# Altium schematic sheet 20_Power_Supply.SchDoc
size A4
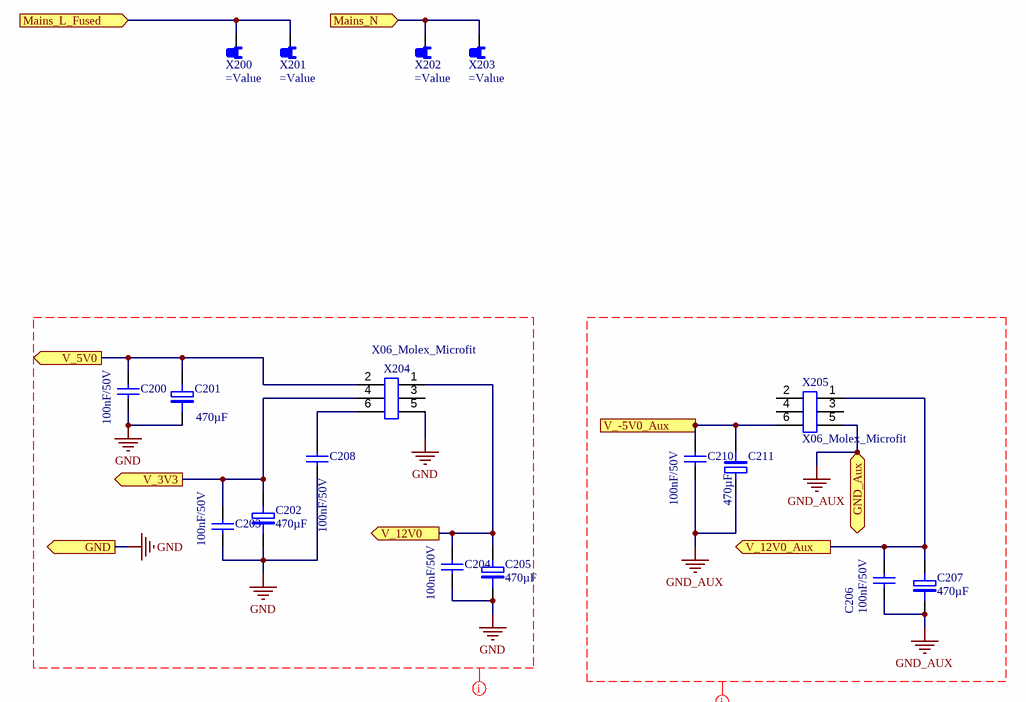
[diagram p0: 20_Power_Supply.SchDoc]

## Parts
C200  100nF/50V  [EIA0603]
C201  470µF  [CAPACITOR-ELKO-RM5-10x20]
C202  470µF  [CAPACITOR-ELKO-RM5-10x20]
C203  100nF/50V  [EIA0603]
C204  100nF/50V  [EIA0603]
C205  470µF  [CAPACITOR-ELKO-RM5-10x20]
C206  100nF/50V  [EIA0603]
C207  470µF  [CAPACITOR-ELKO-RM5-10x20]
C208  100nF/50V  [EIA0603]
C210  100nF/50V  [EIA0603]
C211  470µF  [CAPACITOR-ELKO-RM5-10x20]
X200  (no value)  [X01_FastonPCBTab6.3mm1.8mmHole]
X201  (no value)  [X01_FastonPCBTab6.3mm1.8mmHole]
X202  (no value)  [X01_FastonPCBTab6.3mm1.8mmHole]
X203  (no value)  [X01_FastonPCBTab6.3mm1.8mmHole]
X204  X06_Molex_Microfit  [X06_Molex_Microfit]
X205  X06_Molex_Microfit  [X06_Molex_Microfit]

## Ports
GND (out), GND_Aux (bidir), Mains_L_Fused (in), Mains_N (in), V_3V3 (out), V_5V0 (out), V_12V0 (out), V_12V0_Aux (out), V_-5V0_Aux (in)

## Nets
GND: C200.1 C201.2 C202.2 C203.1 C204.1 C205.2 C208.2 X204.5 ; port GND
GND_AUX: C206.1 C207.2 C210.2 C211.1 X205.5 ; port GND_Aux
Mains_L_Fused: X200.1 X201.1 ; port Mains_L_Fused
Mains_N: X202.1 X203.1 ; port Mains_N
V_3V3: C202.1 C203.2 X204.4 ; port V_3V3
V_5V0: C200.2 C201.1 X204.2 ; port V_5V0
V_12V0: C204.2 C205.1 X204.1 ; port V_12V0
V_12V0_Aux: C206.2 C207.1 X205.1 ; port V_12V0_Aux
V_-5V0_Aux: C210.1 C211.2 X205.6 ; port V_-5V0_Aux
NetC208_1: C208.1 X204.6

Not connected (* = marked no-connect by the designer): X204 3; X205 2 3 4

## Layout directives
net class LV_Net: GND
net class HV_Net-: GND_AUX

## Notes on the sheet
- Assembly variant:
- DIN ISO 2768-mK
- DIN ISO 8015
- standards
- general
- replace for
- DIN EN ISO 1302
- surface
- material number
- description
- document
- number
- replace for index
- type
- version
- date
- drawn by
- checked
- File:
- mod.
- ind.
- quan.
- change number
- sheet
- of
- EBB
- ESP

## Library data of the parts
C200 C203 C204 C206 C208 C210 = C_Open_0603: Generic 0603 ceramic capacitor; Manufacturer: Open; ID: 3; Verified Lib: False; Manufacturer P/N: C_Open_0603; Category: Ceramic; Part_Value: 100nF/50V; Package/Case: 0603; Supplier-1: LCSC; Price: 0.02; created by: Hamad; created On: 12/15/2014
C201 C202 C205 C207 C211 = 50PX470MEFC10X20: 470µF, 50V, Radial, 2000Hrs; Manufacturer: Rubicon; ID: 43; Verified Lib: False; Manufacturer P/N: 50PX470MEFC10X20; Category: Elco; Part_Value: 470µF; Package/Case: D10mmH22mmP5mm; Supplier-1: Digkey; Price: 0.25; created by: Hamad; created On: 8/12/2021
X200-X203 = 7471287: Faston Tab straight DIN46244T3 CuZn Sn plated, pitch 5.08mm,1.8mm locking hole; Manufacturer: Wurth; Part_Value: 6.3 X 0.8mm; ID: 15; Verified Lib: False; Manufacturer P/N: 7471287; Category: Connector; Package/Case: 6.3mmX0.8mm; Price: 0.03; created by: Hamad; created on: 8/13/2021
X204 X205 = 206832-0601: Connector Header THT 6 position 0.118" (3.00mm) Microfit; Manufacturer: Molex; ID: 13; Verified Lib: False; Our Stock: 20; Manufacturer P/N: 206832-0601; Category: Header; Part_Value: X06_Molex_Microfit; Package/Case: THT P3mm; Supplier-1: Digikey; Price: 1.19; created by: Hamad; created on: 8/12/2021